# EAGLE design M452s (EAGLE 6.6.0)
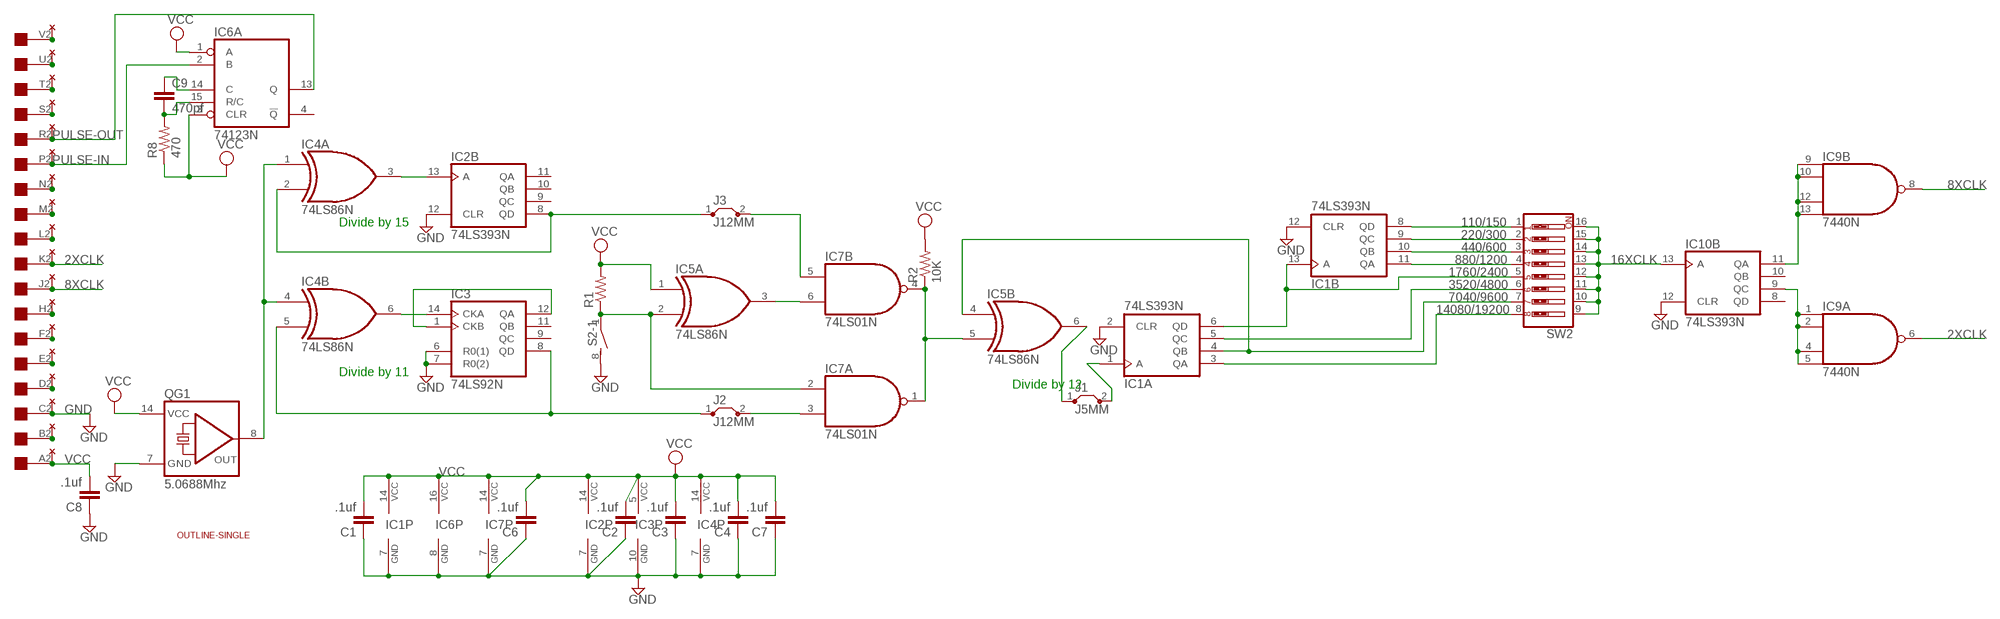
[diagram p0: schematic, sheet 1]

## Parts
C1  .1uf  C-EU050-025X075  [C050-025X075]
C2  .1uf  C-EU050-025X075  [C050-025X075]
C3  .1uf  C-EU050-025X075  [C050-025X075]
C4  .1uf  C-EU050-025X075  [C050-025X075]
C6  .1uf  C-EU050-025X075  [C050-025X075]
C7  .1uf  C-EU050-025X075  [C050-025X075]
C8  .1uf  C-EU050-025X075  [C050-025X075]
C9  470pf  C-EU050-025X075  [C050-025X075]
IC1  74LS393N  [DIL14]
IC2  74LS393N  [DIL14]
IC3  74LS92N  [DIL14]
IC4  74LS86N  [DIL14]
IC5  74LS86N  [DIL14]
IC6  74123N  [DIL16]
IC7  74LS01N  [DIL14]
IC9  7440N  74S20N  [DIL14]
IC10  74LS393N  [DIL14]
J1  J5MM  [05]
J2  J12MM  [12]
J3  J12MM  [12]
QG1  5.0688Mhz  QG5860  [DIL14S]
R1  R-US_0204/7  [0204/7]
R2  10K  R-US_0204/7  [0204/7]
R8  470  R-US_0204/7  [0204/7]
S2  DIP04S  [DIP04S]
SW2  SW_DIP-8  [EDG-08]
U$2  EDGE-1  [EDGE-CON1]
U$3  OUTLINE-SINGLE  [SINGLE]
U$4  THRU-HOLE1  [THRU-HOLE1]

## Nets
2XCLK: IC9.6(A:O) U$2.K2 U$4.K2
8XCLK: IC9.8(B:O) U$2.J2 U$4.J2
16XCLK: IC10.13(B:A) SW2.9 SW2.10 SW2.11 SW2.12 SW2.13 SW2.14 SW2.15 SW2.16
110/150: IC1.8(B:QD) SW2.1
220/300: IC1.9(B:QC) SW2.2
440/600: IC1.10(B:QB) SW2.3
880/1200: IC1.11(B:QA) SW2.4
1760/2400: IC1.6(A:QD) IC1.13(B:A) SW2.5
3520/4800: IC1.5(A:QC) SW2.6
7040/9600: IC1.4(A:QB) IC5.4(B:I0) SW2.7
14080/19200: IC1.3(A:QA) SW2.8
GND: C1.1 C2.1 C3.1 C4.1 C6.1 C7.1 C8.1 IC1.2(A:CLR) IC1.7(P:GND) IC1.12(B:CLR) IC2.7(P:GND) IC2.12(B:CLR) IC3.6(R0(1)) IC3.7(R0(2)) IC3.10(GND) IC4.7(P:GND) IC6.8(P:GND) IC7.7(P:GND) IC10.12(B:CLR) QG1.7(GND) S2.8 U$2.C2 U$4.C2
N$1: IC4.1(A:I0) IC4.4(B:I0) QG1.8(OUT)
N$2: IC2.8(B:QD) IC4.2(A:I1) J3.1
N$3: IC3.8(QD) IC4.5(B:I1) J2.1
N$4: IC3.1(CKB) IC3.12(QA)
N$5: IC3.14(CKA) IC4.6(B:O)
N$6: IC2.13(B:A) IC4.3(A:O)
N$7: IC5.6(B:O) J1.1
N$8: IC5.2(A:I1) IC7.2(A:I0) R1.1 S2.1
N$9: IC5.5(B:I1) IC7.1(A:O) IC7.4(B:O) R2.1
N$10: IC9.1(A:I0) IC9.2(A:I1) IC9.4(A:I2) IC9.5(A:I3) IC10.9(B:QC)
N$11: IC1.1(A:A) J1.2
N$12: IC9.9(B:I0) IC9.10(B:I1) IC9.12(B:I2) IC9.13(B:I3) IC10.11(B:QA)
N$13: IC7.5(B:I0) J3.2
N$14: IC7.3(A:I1) J2.2
N$15: IC5.3(A:O) IC7.6(B:I1)
N$16: U$2.V2 U$4.V2
N$17: U$2.U2 U$4.U2
N$18: U$2.T2 U$4.T2
N$19: U$2.S2 U$4.S2
N$20: U$2.N2 U$4.N2
N$21: C9.2 IC6.15(A:R/C) R8.2
N$22: C9.1 IC6.14(A:C)
N$23: U$2.M2 U$4.M2
N$24: U$2.L2 U$4.L2
N$25: U$2.H2 U$4.H2
N$26: U$2.F2 U$4.F2
N$27: U$2.E2 U$4.E2
N$28: U$2.D2 U$4.D2
N$29: U$2.B2 U$4.B2
PULSE-IN: IC6.2(A:B) U$2.P2 U$4.P2
PULSE-OUT: IC6.13(A:Q) U$2.R2 U$4.R2
VCC: C1.2 C2.2 C3.2 C4.2 C6.2 C7.2 C8.2 IC1.14(P:VCC) IC2.14(P:VCC) IC3.5(VCC) IC4.14(P:VCC) IC5.1(A:I0) IC6.1(A:A) IC6.3(A:CLR) IC6.16(P:VCC) IC7.14(P:VCC) QG1.14(VCC) R1.2 R2.2 R8.1 U$2.A2 U$4.A2
Unconnected: IC2.1(A:A) IC2.2(A:CLR) IC2.3(A:QA) IC2.4(A:QB) IC2.5(A:QC) IC2.6(A:QD) IC2.9(B:QC) IC2.10(B:QB) IC2.11(B:QA) IC3.9(QC) IC3.11(QB) IC4.8(C:O) IC4.9(C:I0) IC4.10(C:I1) IC4.11(D:O) IC4.12(D:I0) IC4.13(D:I1) IC5.8(C:O) IC5.9(C:I0) IC5.10(C:I1) IC5.11(D:O) IC5.12(D:I0) IC5.13(D:I1) IC6.4(A:!Q) IC6.5(B:Q) IC6.6(B:C) IC6.7(B:R/C) IC6.9(B:A) IC6.10(B:B) IC6.11(B:CLR) IC6.12(B:!Q) IC7.8(C:I0) IC7.9(C:I1) IC7.10(C:O) IC7.11(D:I0) IC7.12(D:I1) IC7.13(D:O) IC10.1(A:A) IC10.2(A:CLR) IC10.3(A:QA) IC10.4(A:QB) IC10.5(A:QC) IC10.6(A:QD) IC10.8(B:QD) IC10.10(B:QB) S2.2 S2.3 S2.4 S2.5 S2.6 S2.7

## Notes on the sheet
- Divide by 15
- Divide by 11
- Divide by 12

## Power pins joined to a net without a drawn wire
GND: IC5.7(P:GND) IC9.7(P:GND) IC10.7(P:GND)
VCC: IC5.14(P:VCC) IC9.14(P:VCC) IC10.14(P:VCC)

## Library data of the parts
C1-C4 C6-C9 = rcl:C-EU: CAPACITOR, European symbol
IC1 IC2 IC10 = 74xx-us:74*393: Dual 4-bit decade and binary COUNTER
IC3 = 74xx-us:74*92: Decade, divide by twelve and binary COUNTER
IC4 IC5 = 74xx-us:74*86: Quad 2-input EXCLUSIV-OR (XOR) gate
IC6 = 74xx-us:74*123: Retriggerable monostable MULTIVIBRATOR
IC7 = 74xx-us:74*01: Quad 2-input NAND gate, open collector
IC9 = 74xx-us:74*20: Dual 4-input NAND gate
J1-J3 = jumper:J: Bridge
QG1 = crystal:QG5860: CRYSTAL RESONATOR; OC_FARNELL: unknown; OC_NEWARK: unknown
R1 R2 R8 = rcl:R-US_: RESISTOR, American symbol
S2 = switch-dil:DIP04S: DIL/CODE SWITCH; OC_FARNELL: unknown; OC_NEWARK: unknown
SW2 = special:SW_DIP-8: DIP SWITCH
U$2 = dec-con:EDGE-1: Single-Sided DEC Edge Connector -- (side 2)
U$3 = dec-con:OUTLINE-*: Board outlines for DEC boards.
U$4 = dec-con:THRU-HOLE1: Thru-Hole addition to double-sided edge connector.

## Board
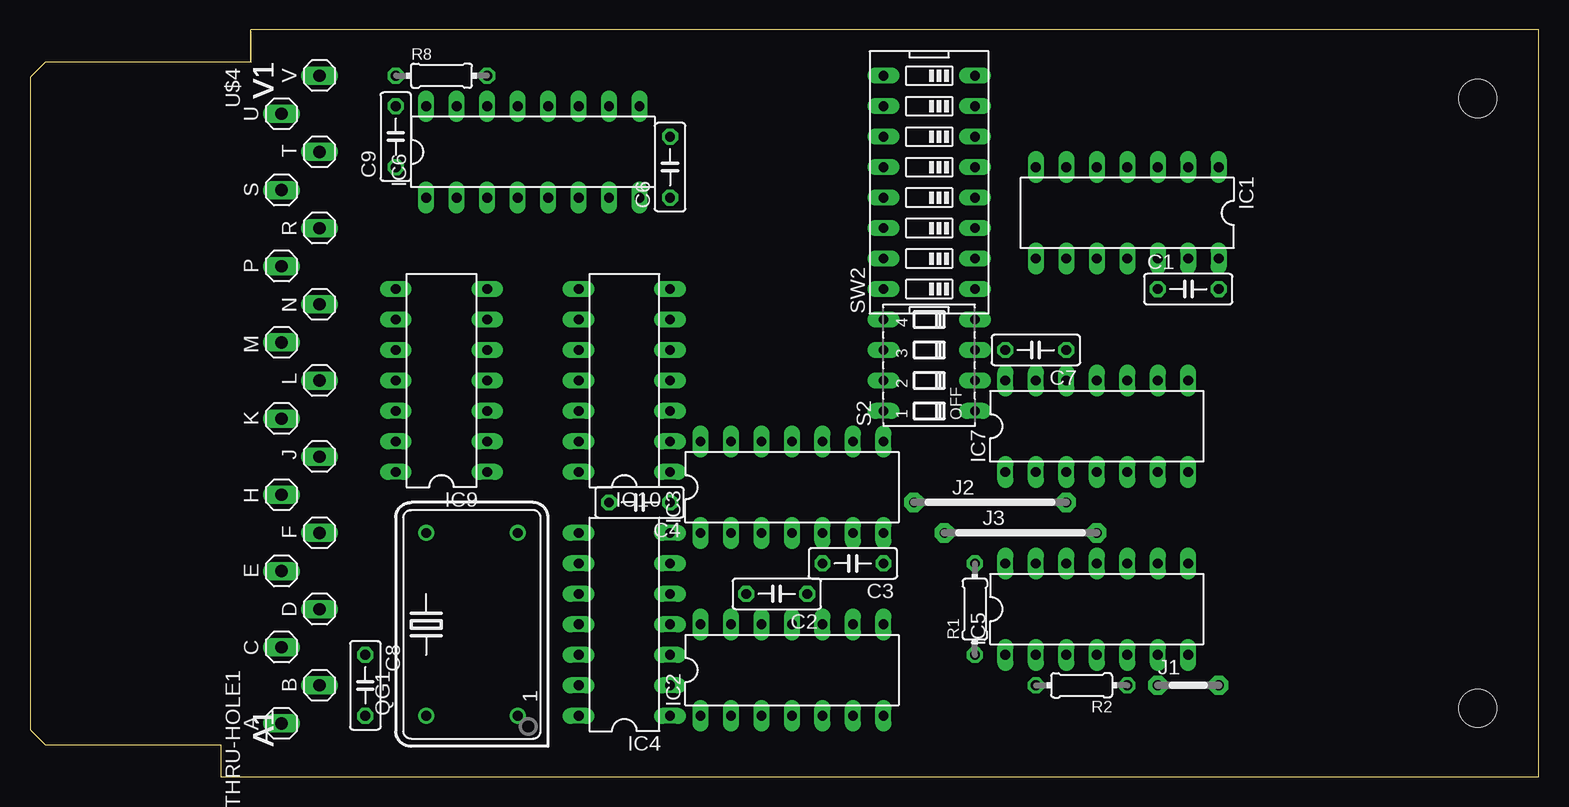
[diagram p1: board, top side]
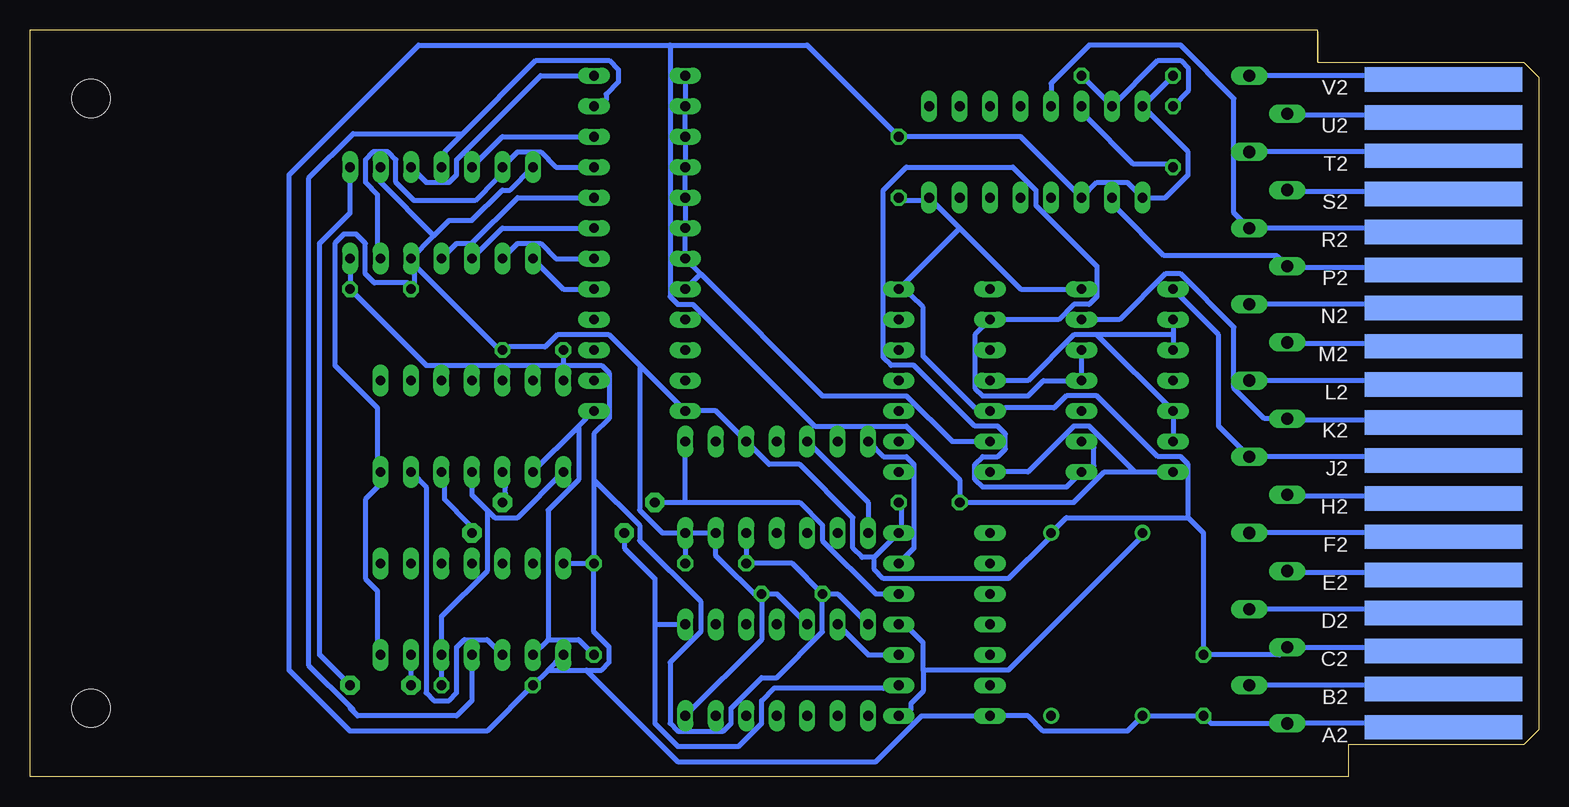
[diagram p2: board, bottom side, seen from below]

Size 125.73 x 62.23 mm. Coordinates in mm from the lower left corner, seen from the top.
Copper layers (1+16): Top 0.035mm / dielectric 1.5mm / Bottom 0.035mm
Design rules "16mils": minimum track width 16mil, minimum drill 32mil, track to track 15mil, track to pad 10mil, pad to pad 10mil, via to via 10mil, smd to smd 10mil, copper to edge 13mil, drill to drill 10mil, minimum pad ring 10mil, minimum via ring 8mil, stop-mask expansion 0mil, vias tented up to drill 0mil, thermal gap 10mil

### Footprints (pad centres in the part's own frame; a part is rotated, then mirrored left to right if it is on the bottom)
C050-025X075 = drill 0.813 octagon: 1 -2.54,0; 2 2.54,0
DIL14 = drill 0.813 long: 1 -7.62,-3.81; 2 -5.08,-3.81; 3 -2.54,-3.81; 4 0,-3.81; 5 2.54,-3.81; 6 5.08,-3.81; 7 7.62,-3.81; 8 7.62,3.81; 9 5.08,3.81; 10 2.54,3.81; 11 0,3.81; 12 -2.54,3.81; 13 -5.08,3.81; 14 -7.62,3.81
DIL16 = drill 0.813 long: 1 -8.89,-3.81; 2 -6.35,-3.81; 3 -3.81,-3.81; 4 -1.27,-3.81; 5 1.27,-3.81; 6 3.81,-3.81; 7 6.35,-3.81; 8 8.89,-3.81; 9 8.89,3.81; 10 6.35,3.81; 11 3.81,3.81; 12 1.27,3.81; 13 -1.27,3.81; 14 -3.81,3.81; 15 -6.35,3.81; 16 -8.89,3.81
05 = drill 0.813 pad 1.6 octagon: 1 -2.54,0; 2 2.54,0
12 = drill 0.813 pad 1.6 octagon: 1 -6.35,0; 2 6.35,0
DIL14S = drill 0.813: 1 -7.62,-3.81; 7 7.62,-3.81; 8 7.62,3.81; 14 -7.62,3.81
0204/7 = drill 0.813 octagon: 1 -3.81,0; 2 3.81,0
DIP04S = drill 0.813 long: 1 -3.81,-3.81; 2 -1.27,-3.81; 3 1.27,-3.81; 4 3.81,-3.81; 5 3.81,3.81; 6 1.27,3.81; 7 -1.27,3.81; 8 -3.81,3.81
EDG-08 = drill 0.813 long: 1 -8.89,-3.81; 2 -6.35,-3.81; 3 -3.81,-3.81; 4 -1.27,-3.81; 5 1.27,-3.81; 6 3.81,-3.81; 7 6.35,-3.81; 8 8.89,-3.81; 9 8.89,3.81; 10 6.35,3.81; 11 3.81,3.81; 12 1.27,3.81; 13 -1.27,3.81; 14 -3.81,3.81; 15 -6.35,3.81; 16 -8.89,3.81
EDGE-CON1 = smd 13.106 x 2.032 bottom: A2 7.938,4.128; B2 7.938,7.303; C2 7.938,10.477; D2 7.938,13.652; E2 7.938,16.828; F2 7.938,20.003; H2 7.938,23.177; J2 7.938,26.352; K2 7.938,29.527; L2 7.938,32.703; M2 7.938,35.877; N2 7.938,39.053; P2 7.938,42.227; R2 7.938,45.403; S2 7.938,48.578; T2 7.938,51.752; U2 7.938,54.928; V2 7.938,58.102
SINGLE = hole 3.175: 120.65,56.515; 120.65,5.715
THRU-HOLE1 = drill 1.016 long: A2 28.575,3.175; B2 25.4,6.35; C2 22.225,3.175; D2 19.05,6.35; E2 15.875,3.175; F2 12.7,6.35; H2 9.525,3.175; J2 6.35,6.35; K2 3.175,3.175; L2 0,6.35; M2 -3.175,3.175; N2 -6.35,6.35; P2 -9.525,3.175; R2 -12.7,6.35; S2 -15.875,3.175; T2 -19.05,6.35; U2 -22.225,3.175; V2 -25.4,6.35

### Placement (x,y rotation side)
C1  96.52,40.64 0 top
C2  62.23,15.24 180 top
C3  68.58,17.78 180 top
C4  50.8,22.86 180 top
C6  53.34,50.8 90 top
C7  83.82,35.56 180 top
C8  27.94,7.62 270 top
C9  30.48,53.34 90 top
IC1  91.44,46.99 180 top
IC2  63.5,8.89 0 top
IC3  63.5,24.13 0 top
IC4  49.53,12.7 90 top
IC5  88.9,13.97 0 top
IC6  41.91,52.07 0 top
IC7  88.9,29.21 0 top
IC9  34.29,33.02 90 top
IC10  49.53,33.02 90 top
J1  96.52,7.62 0 top
J2  80.01,22.86 0 top
J3  82.55,20.32 0 top
QG1  36.83,12.7 90 top
R1  78.74,13.97 90 top
R2  87.63,7.62 180 top
R8  34.29,58.42 0 top
S2  74.93,34.29 90 top
SW2  74.93,49.53 90 top
U$2  0,0 0 top
U$3  0,0 0 top
U$4  17.78,33.02 270 top

### Tracks (layer width: path | path; a pad name or v marks a point on that pad's centre or on a via)
2XCLK
  Bottom 0.406: U$2.K2 8.13,29.72 20.83,29.72 U$4.K2 22.86,29.84 25.4,32.38 25.4,37.47 29.85,41.91 31.12,41.91 34.93,38.1 IC9.6
8XCLK
  Bottom 0.406: U$2.J2 8.13,26.42 8.38,26.67 U$4.J2 26.67,29.21 26.67,36.83 IC9.8
16XCLK
  Bottom 0.406: SW2.9 SW2.10 SW2.11 SW2.12 SW2.13 SW2.14 SW2.15 69.85,41.91 | IC10.13 48.9,27.94 52.71,31.75 59.69,31.75 69.85,41.91 | 69.85,41.91 SW2.16
110/150
  Bottom 0.406: SW2.1 81.28,40.64 IC1.8
220/300
  Bottom 0.406: SW2.2 81.92,43.18 83.19,44.45 85.09,44.45 IC1.9
440/600
  Bottom 0.406: SW2.3 86.36,45.72 IC1.10
880/1200
  Bottom 0.406: SW2.4 85.09,48.26 88.9,44.45 90.17,44.45 IC1.11
1760/2400
  Bottom 0.406: IC1.13 96.77,44.45 96.77,48.51 97.79,49.53 97.79,51.44 97.16,52.07 95.89,52.07 95.25,51.44 95.25,49.53 93.73,48.01 88.65,48.01 86.87,49.78 IC1.6 85.09,52.07 83.19,52.07 81.92,50.8 SW2.5
3520/4800
  Bottom 0.406: SW2.6 86.36,53.34 IC1.5
7040/9600
  Bottom 0.406: 89.66,53.59 83.57,59.69 77.47,59.69 76.71,58.93 76.71,57.91 77.72,56.9 77.72,56.39 SW2.7 | 89.66,53.59 91.19,52.07 IC1.4 | 98.81,5.59 99,5.78 | 99,5.78 102.49,9.27 102.49,49.91 98.81,53.59 89.66,53.59 | IC5.4 88.9,6.35 90.17,5.08 98.43,5.08 99.06,5.71 99,5.78
14080/19200
  Bottom 0.406: SW2.8 83.19,58.42 90.17,51.44 90.17,50.16 90.81,49.53 92.71,49.53 IC1.3
GND
  Bottom 0.406: C6.1 52.83,48.01 51.31,48.01 IC6.8 48.26,45.72 | 55.37,18.29 55.37,17.27 54.61,16.51 44.2,16.51 40.89,19.81 QG1.7 39.37,21.59 29.21,21.59 | 55.37,18.29 IC4.7 53.09,20.83 53.09,22.35 C4.1 | IC5.7 96.77,11.43 96.77,15.49 97.79,16.51 97.79,23.11 96.77,24.13 IC7.7 96.77,26.67 96.77,30.73 100.33,34.29 100.33,44.45 99.57,45.21 98.55,45.21 97.79,44.45 97.79,41.91 97.03,41.15 94.23,41.15 C1.1 93.73,41.15 93.73,41.91 IC1.12 | 55.37,18.29 56.39,18.29 57.15,19.05 57.15,21.59 61.6,26.04 64.14,26.04 IC3.10 68.58,30.48 S2.8 74.93,34.29 | IC1.12 93.47,42.42 86.87,35.81 C7.1 85.85,35.81 82.8,35.81 81.79,36.83 77.47,36.83 74.93,34.29 | 21.08,10.92 U$4.C2 | 13.97,10.67 8.13,10.67 U$2.C2 13.97,10.79 U$4.C2 | IC9.7 43.18,40.64 48.26,45.72 | 48.26,45.72 IC10.7 52.32,40.13 51.31,39.12 51.31,35.05 46.99,30.73 IC10.12 44.45,30.73 40.39,30.73 39.37,31.75 36.83,31.75 31.75,26.67 29.85,26.67 29.21,26.04 29.21,21.59 | IC3.7 C3.1 | IC3.7 IC3.6 68.58,18.41 64.77,14.61 | IC2.12 63.5,15.24 C2.1 64.77,14.61 | IC2.7 64.77,11.43 64.77,14.61 | IC1.7 85.73,48.9 86.36,48.9 88.9,46.35 90.81,46.35 92.08,45.09 | IC1.12 92.08,45.09 | IC1.2 96.52,49.53 92.08,45.09 | IC3.7 73.03,20.32 74.93,22.23 74.93,34.29 | U$4.C2 21.59,10.16 C8.1 27.94,20.32 29.21,21.59
N$1
  Bottom 0.406: 51.31,8.89 51.31,11.18 52.32,12.19 IC4.4 | 51.31,8.89 51.31,7.11 52.32,6.1 52.32,5.59 IC4.1 | 51.31,8.89 44.2,8.89 33.27,19.81 QG1.8
N$2
  Bottom 0.406: IC4.2 54.61,7.37 63.75,7.37 64.77,6.35 64.77,4.45 66.68,2.54 71.76,2.54 73.66,4.45 73.66,12.7 | 73.66,12.7 73.66,16.51 76.2,19.05 J3.1 | 73.66,12.7 IC2.8
N$3
  Bottom 0.406: IC4.5 55.25,15.24 59.69,19.68 59.69,20.95 61.6,22.86 71.12,22.86 | J2.1 71.12,22.86 | 71.12,22.86 IC3.8
N$4
  Bottom 0.406: IC3.1 55.88,22.86 IC3.12
N$5
  Bottom 0.406: IC4.6 52.07,19.05 52.07,26.04 52.71,26.67 54.61,26.67 IC3.14
N$6
  Bottom 0.406: IC4.3 55.88,10.16 IC2.13
N$7
  Bottom 0.406: J1.1 IC5.6
N$8
  Bottom 0.406: R1.1 80.01,11.43 82.55,11.43 | IC5.2 82.55,11.43 | IC7.2 80.01,29.21 | 80.01,29.21 S2.1 | 82.55,11.43 82.55,22.23 80.01,24.77 80.01,29.21
N$9
  Bottom 0.406: IC7.1 85.09,21.59 87,21.59 87.63,22.23 | 87.63,22.23 88.9,23.5 IC7.4 | 87.63,22.23 87.63,17.14 91.44,13.34 IC5.5 R2.1
N$10
  Bottom 0.406: IC9.2 37.08,27.43 37.08,25.91 IC9.1 39.37,24.13 46.36,24.13 46.99,24.77 46.99,26.04 46.36,26.67 45.09,26.67 44.45,27.3 44.45,28.57 45.09,29.21 46.99,29.21 52.07,34.29 53.98,34.29 54.61,34.92 54.61,48.9 52.71,50.8 43.82,50.8 41.91,48.9 41.91,47.62 36.83,42.55 36.83,40.01 37.47,39.37 38.74,39.37 40.01,38.1 IC10.9 46.99,36.83 46.99,32.38 46.36,31.75 42.55,31.75 41.28,33.02 IC9.4 IC9.5
N$11
  Bottom 0.406: IC1.1 99.06,46.99 101.6,44.45 101.6,10.16 J1.2
N$12
  Bottom 0.406: IC9.13 IC9.12 36.83,36.83 | IC9.9 30.48,36.83 | 30.48,36.83 IC9.10 | IC10.11 42.55,33.02 38.74,36.83 36.83,36.83 | 30.48,36.83 36.83,36.83
N$13
  Bottom 0.406: IC7.5 91.19,24.13 91.19,23.11 89.15,21.08 J3.2
N$14
  Bottom 0.406: IC7.3 86.11,24.13 86.11,23.62 J2.2
N$15
  Bottom 0.406: IC5.3 87.63,11.43 89.54,11.43 90.17,10.79 90.17,6.99 90.81,6.35 92.08,6.35 92.71,6.99 92.71,24.13 IC7.6
N$16
  Bottom 0.406: U$4.V2 8.38,58.42 8.13,58.17 U$2.V2
N$17
  Bottom 0.406: 21.08,55.37 U$4.U2 20.83,55.12 8.13,55.12 U$2.U2
N$18
  Bottom 0.406: U$4.T2 8.38,52.07 8.13,51.82 U$2.T2
N$19
  Bottom 0.406: 21.08,49.02 U$4.S2 20.83,48.77 8.13,48.77 U$2.S2
N$20
  Bottom 0.406: U$4.N2 8.38,39.37 8.13,39.12 U$2.N2
N$21
  Bottom 0.406: C9.2 29.21,57.15 29.21,59.05 29.85,59.69 31.75,59.69 IC6.15 R8.2
N$22
  Bottom 0.406: C9.1 30.99,51.05 33.78,51.05 37.59,54.86 IC6.14
N$23
  Bottom 0.406: 21.08,36.32 U$4.M2 20.83,36.07 8.13,36.07 U$2.M2
N$24
  Bottom 0.406: U$4.L2 8.38,33.02 8.13,32.77 U$2.L2
N$25
  Bottom 0.406: 21.08,23.62 U$4.H2 20.83,23.37 8.13,23.37 U$2.H2
N$26
  Bottom 0.406: U$4.F2 8.38,20.32 8.13,20.07 U$2.F2
N$27
  Bottom 0.406: 21.08,17.27 U$4.E2 20.83,17.02 8.13,17.02 U$2.E2
N$28
  Bottom 0.406: U$4.D2 8.38,13.97 8.13,13.72 U$2.D2
N$29
  Bottom 0.406: U$4.B2 8.38,7.62 8.13,7.37 U$2.B2
PULSE-IN
  Bottom 0.406: IC6.2 35.05,47.24 31.24,43.43 21.84,43.43 U$4.P2 20.83,42.42 8.13,42.42 U$2.P2
PULSE-OUT
  Bottom 0.406: U$2.R2 8.13,45.47 8.38,45.72 U$4.R2 25.4,46.99 25.4,56.52 29.85,60.96 37.47,60.96 40.64,57.78 IC6.13
VCC
  Bottom 0.406: 33.66,25.4 36.2,25.4 38.74,22.86 C4.2 48.26,24.77 52.71,29.21 60.33,29.21 70.49,39.37 71.76,39.37 72.39,40.01 72.39,60.96 | 33.66,25.4 IC9.14 | IC10.14 42.55,25.4 38.74,29.21 37.47,29.21 33.66,25.4 | R8.1 IC6.16 29.21,52.07 29.21,50.16 31.12,48.26 IC6.1 34.29,49.53 36.83,49.53 IC6.3 43.18,53.34 C6.2 60.96,60.96 72.39,60.96 | U$2.A2 8.26,4.45 U$4.A2 27.31,4.45 C8.2 QG1.14 34.29,3.81 41.28,3.81 42.55,5.08 IC4.14 51.44,5.08 55.25,1.27 71.76,1.27 79.38,8.89 | IC3.5 C3.2 62.23,17.78 C2.2 | IC2.14 58.42,15.24 C2.2 | IC5.14 R1.2 | 82.55,8.89 R2.2 87.63,3.81 99.06,3.81 104.14,8.89 104.14,50.16 93.35,60.96 72.39,60.96 | 82.55,8.89 IC5.1 | R1.2 78.74,12.06 77.47,10.79 77.47,9.53 78.11,8.89 79.38,8.89 | 82.55,8.89 79.38,8.89 | C7.2 81.28,34.29 | 81.28,34.29 IC7.14 | IC1.14 C1.2 92.71,34.29 81.28,34.29 | 78.74,24.77 78.74,28.57 77.47,29.84 77.47,33.66 78.11,34.29 81.28,34.29 | 78.74,24.77 R1.2 | C2.2 59.69,12.06 63.5,8.26 64.77,8.26 67.31,5.71 67.31,4.45 67.95,3.81 71.76,3.81 72.39,4.45 72.39,9.53 69.85,12.06 69.85,14.61 74.93,19.68 74.93,20.95 78.74,24.77

### Text on the board
tNames: V1 | V1 | V1 | V1 | V1 | V1 | V1 | V1 | V1 | V1 | V1 | V1 | V1 | V1 | V1 | V1 | V1 | V1 | V1 | V1 | V1 | V1 | V1 | V1 | V1 | V1 | V1 | V1 | V1 | V1 | V1 | V1 | A1 | A1 | A1 | A1 | A1 | A1 | A1 | A1 | A1 | A1 | A1 | A1 | A1 | A1 | A1 | A1 | A1 | A1 | A1 | A1 | A1 | A1 | A1 | A1 | A1 | A1 | A1 | A1 | A1 | A1 | A1 | A1